# Altium schematic sheet Schematic.schdoc
size 707 x 423 mm
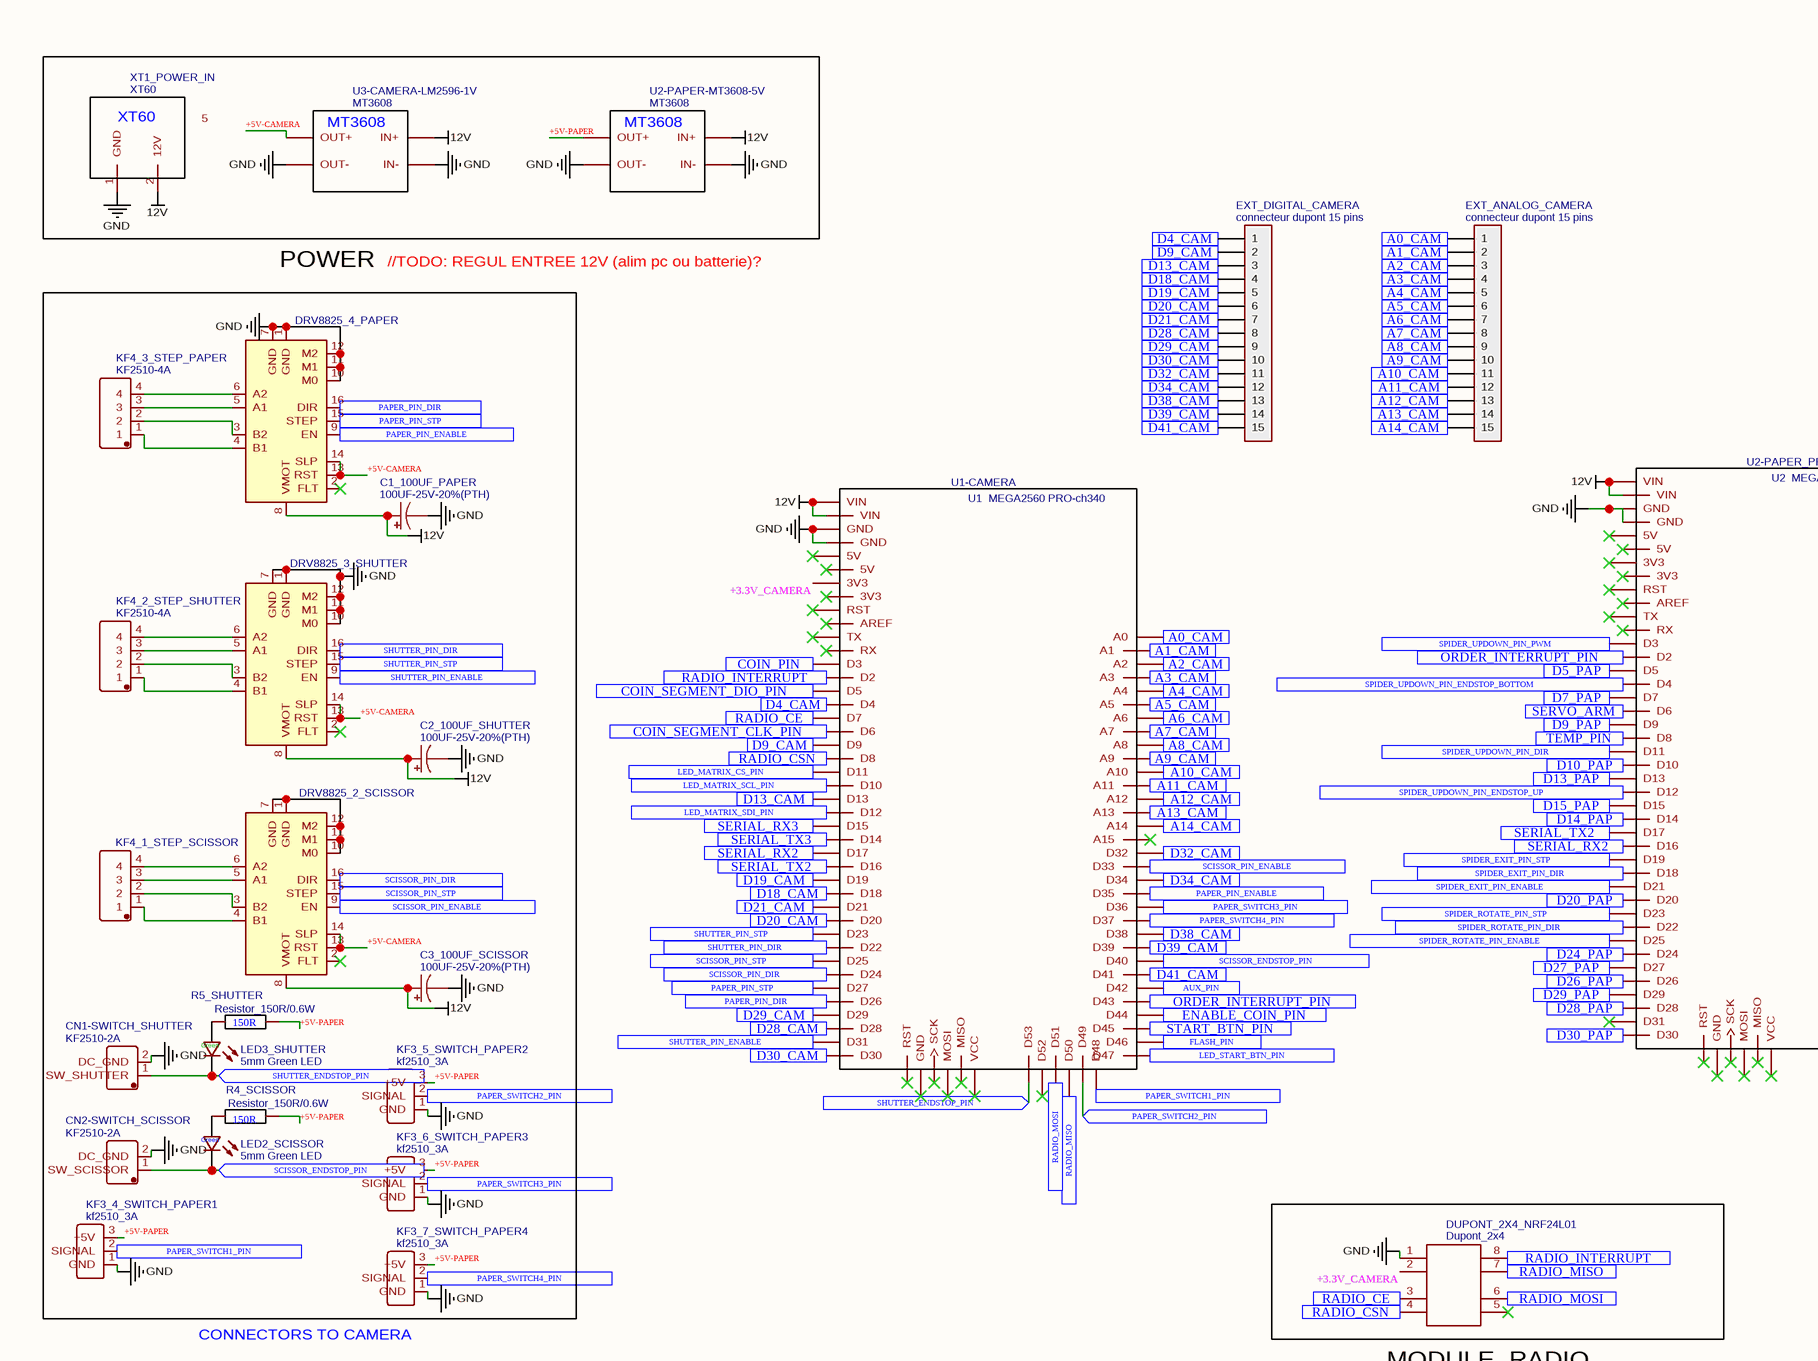
[diagram p0: Schematic.schdoc, top left]
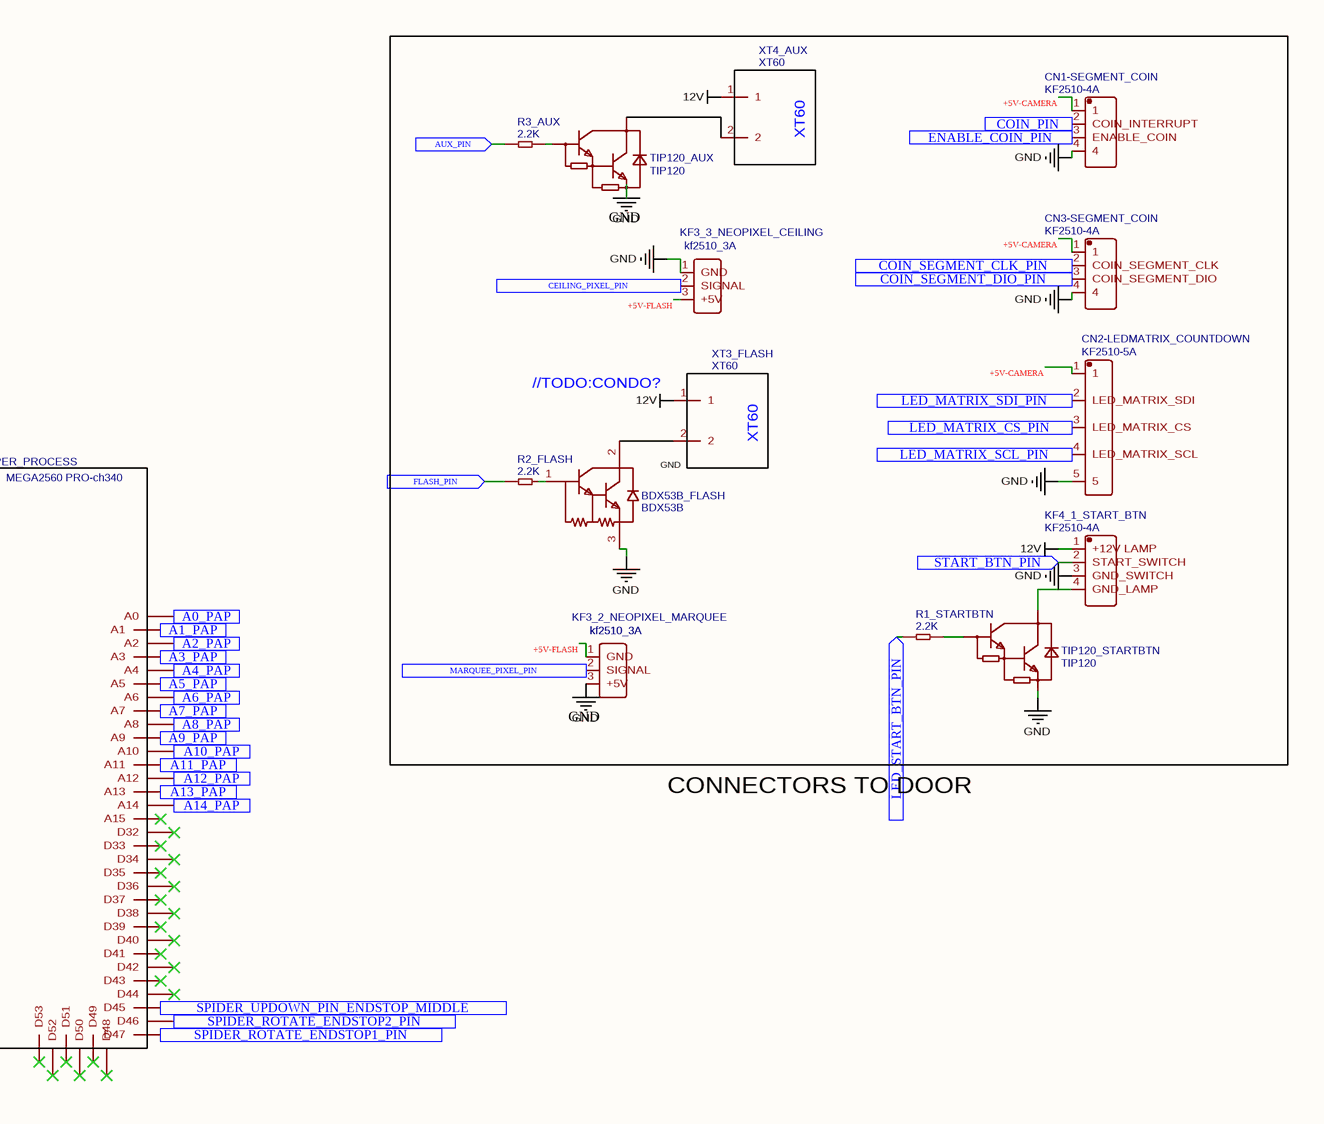
[diagram p1: Schematic.schdoc, top right]
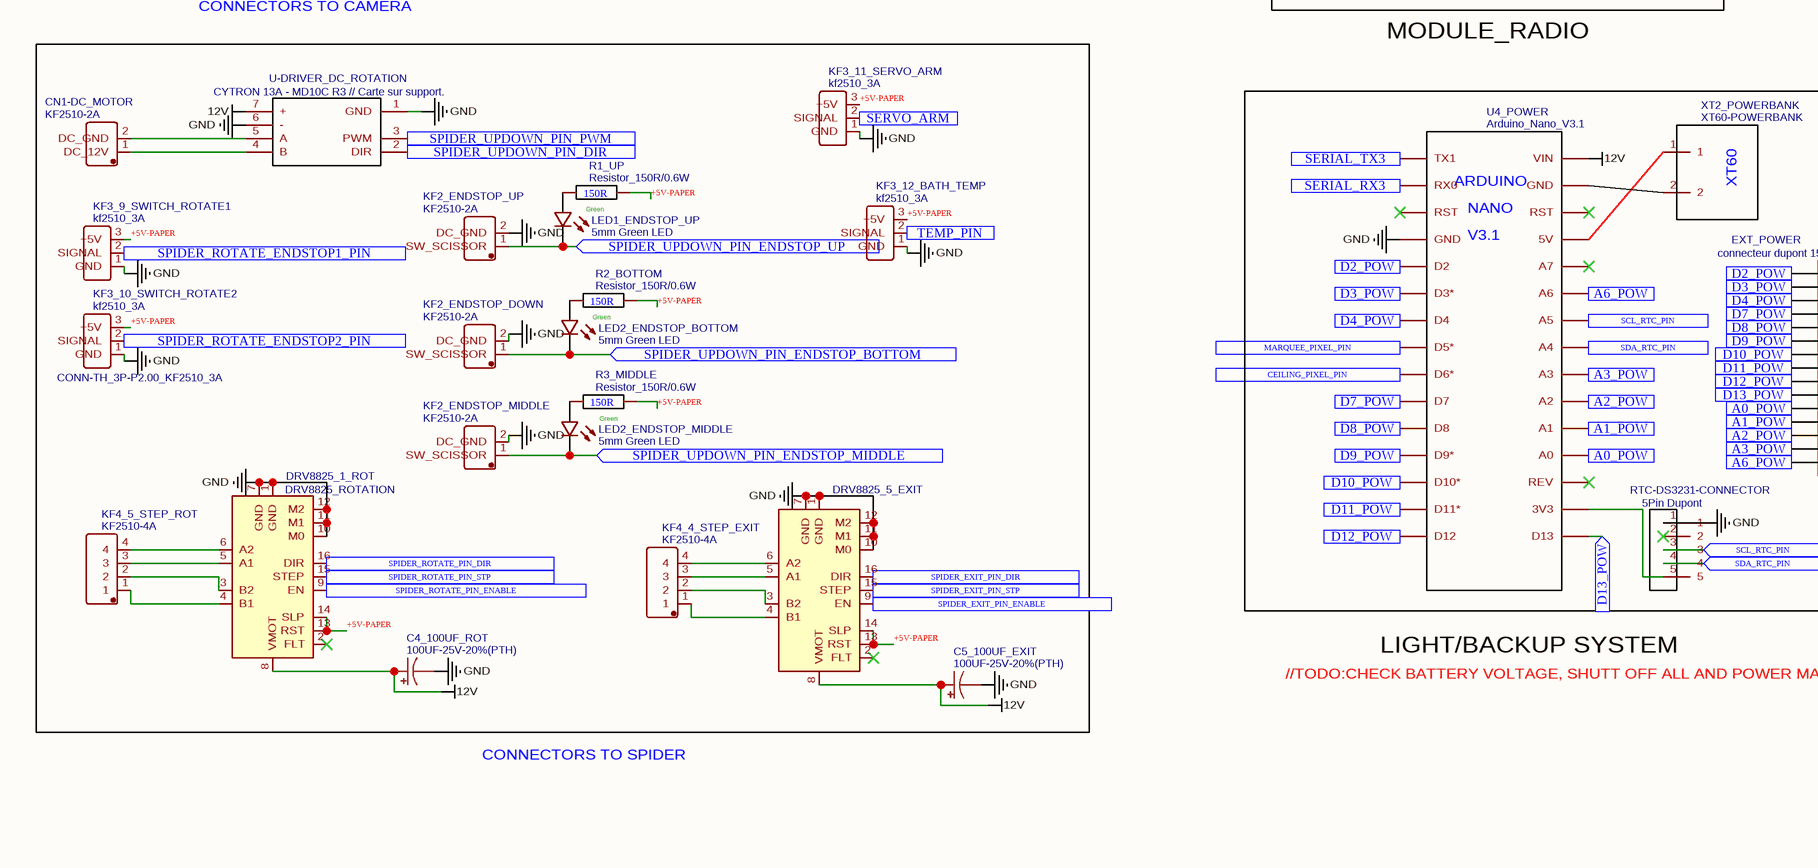
[diagram p2: Schematic.schdoc, bottom left]
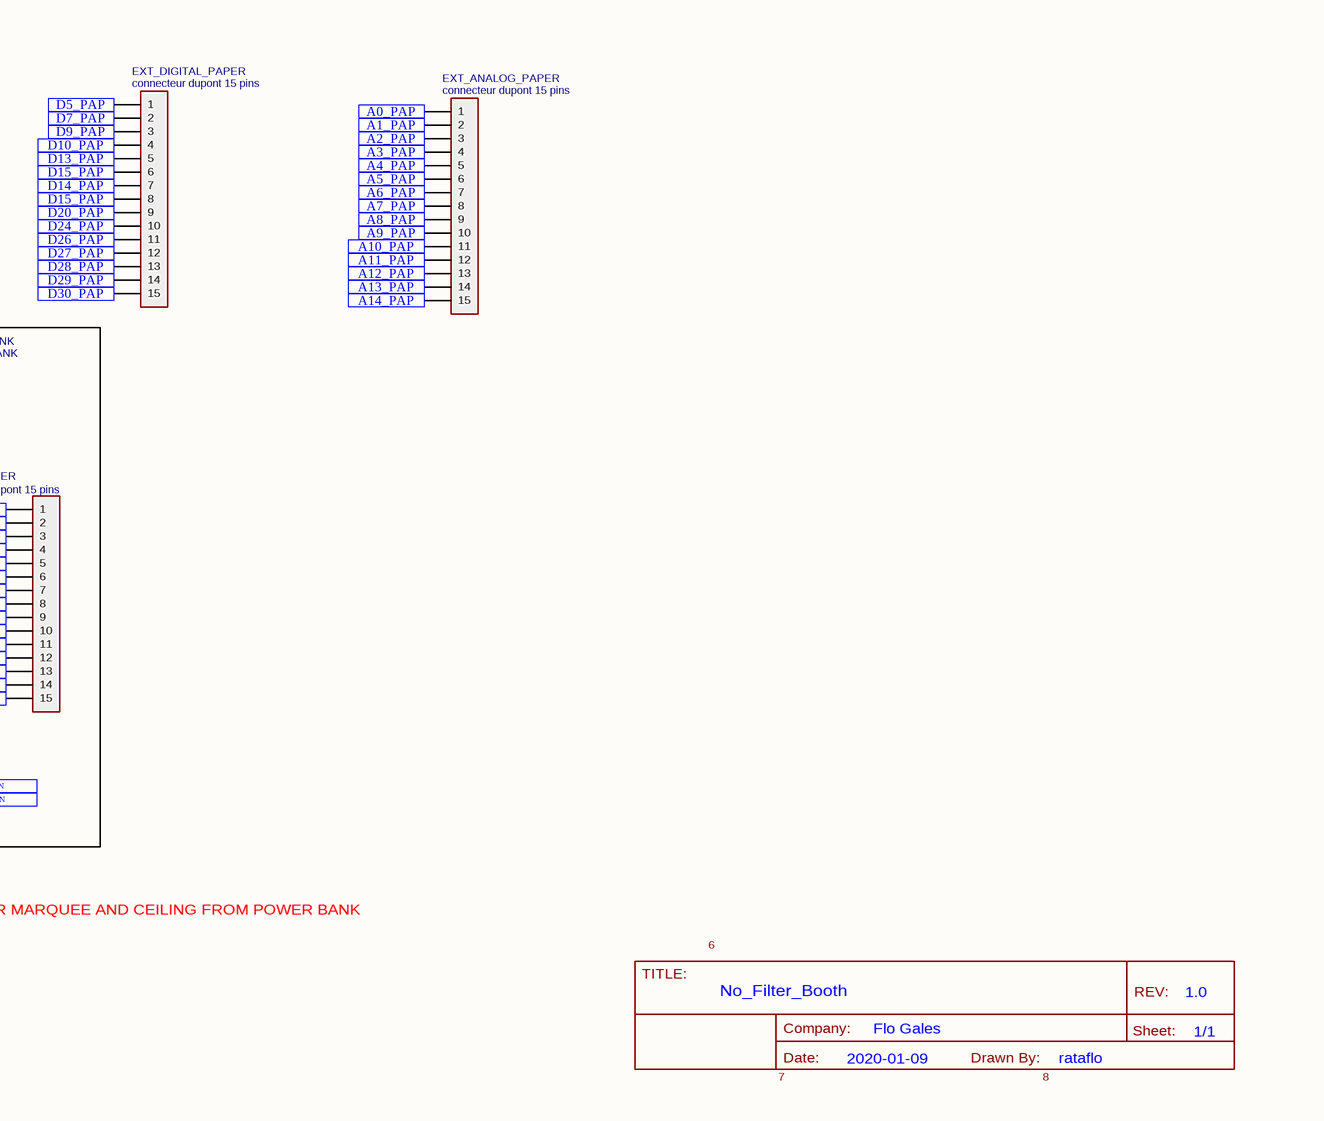
[diagram p3: Schematic.schdoc, bottom right]

## Parts
BDX53B_FLASH  BDX53B  [TO-220]
C1_100UF_PAPER  100UF-25V-20%(PTH)  [CPOL-RADIAL-100UF-25V]
C2_100UF_SHUTTER  100UF-25V-20%(PTH)  [CPOL-RADIAL-100UF-25V]
C3_100UF_SCISSOR  100UF-25V-20%(PTH)  [CPOL-RADIAL-100UF-25V]
C4_100UF_ROT  100UF-25V-20%(PTH)  [CPOL-RADIAL-100UF-25V]
C5_100UF_EXIT  100UF-25V-20%(PTH)  [CPOL-RADIAL-100UF-25V]
CN1-DC_MOTOR  KF2510-2A  [CONN-TH_KF2510-2A]
CN1-SEGMENT_COIN  KF2510-4A  [CONN-TH_4P-P2.54_KF2510-4A]
CN1-SWITCH_SHUTTER  KF2510-2A  [CONN-TH_KF2510-2A]
CN2-LEDMATRIX_COUNTDOWN  KF2510-5A  [KF2510-5A]
CN2-SWITCH_SCISSOR  KF2510-2A  [CONN-TH_KF2510-2A]
CN3-SEGMENT_COIN  KF2510-4A  [CONN-TH_4P-P2.54_KF2510-4A]
CN6-STEP_SCISSOR  KF4_1_STEP_SCISSOR  [CONN-TH_4P-P2.54_KF2510-4A]
DRV8825_1_ROT  DRV8825_ROTATION  [POLOLU_BREAKOUT-16_15.2X20.3MM]
DRV8825_2_SCISSOR  DRV8825_SCISSOR  [POLOLU_BREAKOUT-16_15.2X20.3MM]  (value not drawn)
DRV8825_3_SHUTTER  DRV8825_SHUTTER  [POLOLU_BREAKOUT-16_15.2X20.3MM]  (value not drawn)
DRV8825_4_PAPER  DRV8825_PAPER  [POLOLU_BREAKOUT-16_15.2X20.3MM]  (value not drawn)
DRV8825_5_EXIT  DRV8825_EXIT  [POLOLU_BREAKOUT-16_15.2X20.3MM]  (value not drawn)
DUPONT_2X4_NRF24L01  Dupont_2x4  [HEADER 4X2]
EXT_ANALOG_CAMERA  connecteur dupont 15 pins  [DUPONT_MALE_16X1_ARNOZ]
EXT_ANALOG_PAPER  connecteur dupont 15 pins  [DUPONT_MALE_16X1_ARNOZ]
EXT_DIGITAL_CAMERA  connecteur dupont 15 pins  [DUPONT_MALE_16X1_ARNOZ]
EXT_DIGITAL_PAPER  connecteur dupont 15 pins  [DUPONT_MALE_16X1_ARNOZ]
EXT_POWER  connecteur dupont 15 pins  [DUPONT_MALE_16X1_ARNOZ]
KF2_ENDSTOP_DOWN  KF2510-2A  [CONN-TH_KF2510-2A]
KF2_ENDSTOP_MIDDLE  KF2510-2A  [CONN-TH_KF2510-2A]
KF2_ENDSTOP_UP  KF2510-2A  [CONN-TH_KF2510-2A]
KF3_2_NEOPIXEL_MARQUEE  kf2510_3A  [CONN-TH_3P-P2.00_KF2510_3A]
KF3_3_NEOPIXEL_CEILING  kf2510_3A  [CONN-TH_3P-P2.00_KF2510_3A]
KF3_4_SWITCH_PAPER1  kf2510_3A  [CONN-TH_3P-P2.00_KF2510_3A]
KF3_5_SWITCH_PAPER2  kf2510_3A  [CONN-TH_3P-P2.00_KF2510_3A]
KF3_6_SWITCH_PAPER3  kf2510_3A  [CONN-TH_3P-P2.00_KF2510_3A]
KF3_7_SWITCH_PAPER4  kf2510_3A  [CONN-TH_3P-P2.00_KF2510_3A]
KF3_9_SWITCH_ROTATE1  kf2510_3A  [CONN-TH_3P-P2.00_KF2510_3A]
KF3_10_SWITCH_ROTATE2  kf2510_3A  [CONN-TH_3P-P2.00_KF2510_3A]
KF3_11_SERVO_ARM  kf2510_3A  [CONN-TH_3P-P2.00_KF2510_3A]
KF3_12_BATH_TEMP  kf2510_3A  [CONN-TH_3P-P2.00_KF2510_3A]
KF4_1_START_BTN  KF2510-4A  [CONN-TH_4P-P2.54_KF2510-4A]
KF4_2_STEP_SHUTTER  KF2510-4A  [CONN-TH_4P-P2.54_KF2510-4A]
KF4_3_STEP_PAPER  KF2510-4A  [CONN-TH_4P-P2.54_KF2510-4A]
KF4_4_STEP_EXIT  KF2510-4A  [CONN-TH_4P-P2.54_KF2510-4A]
KF4_5_STEP_ROT  KF2510-4A  [CONN-TH_4P-P2.54_KF2510-4A]
LED1_ENDSTOP_UP  5mm Green LED  [5MM_LED_2.54]
LED2_ENDSTOP_BOTTOM  5mm Green LED  [5MM_LED_2.54]
LED2_ENDSTOP_MIDDLE  5mm Green LED  [5MM_LED_2.54]
LED2_SCISSOR  5mm Green LED  [5MM_LED_2.54]
LED3_SHUTTER  5mm Green LED  [5MM_LED_2.54]
R1_STARTBTN  2.2K  [RES-2.3]
R1_UP  Resistor_150R/0.6W  [ER_RESISTOR_150R/0.6_W]
R2_BOTTOM  Resistor_150R/0.6W  [ER_RESISTOR_150R/0.6_W]
R2_FLASH  2.2K  [RES-2.3]
R3_AUX  2.2K  [RES-2.3]
R3_MIDDLE  Resistor_150R/0.6W  [ER_RESISTOR_150R/0.6_W]
R4_SCISSOR  Resistor_150R/0.6W  [ER_RESISTOR_150R/0.6_W]
R5_SHUTTER  Resistor_150R/0.6W  [ER_RESISTOR_150R/0.6_W]
RTC-DS3231-CONNECTOR  5Pin Dupont  [5PIN DUPONT]
TEST  test2  (value not drawn)
TIP120_AUX  TIP120  [TO-220-3_L10.0-W4.5-P2.54-L]
TIP120_STARTBTN  TIP120  [TO-220-3_L10.0-W4.5-P2.54-L]
U1-CAMERA  MEGA2560_CAMERA  [MEGA2560 PRO-CH340G]  (value not drawn)
U2-PAPER-MT3608-5V  MT3608  [MT3608]
U2-PAPER_PROCESS  MEGA2560_PAPER_PROCESS  [MEGA2560 PRO-CH340G]  (value not drawn)
U3-CAMERA-LM2596-1V  MT3608  [MT3608]
U4_POWER  Arduino_Nano_V3.1  [ARDUINO NANO]
U-DRIVER_DC_ROTATION  CYTRON 13A - MD10C R3 // Carte sur support.  [MD10C]
XT1_POWER_IN  XT60  [XT60]
XT2_POWERBANK  XT60-POWERBANK  [XT60]
XT3_FLASH  XT60  [XT60]
XT4_AUX  XT60  [XT60]

## Blocks framed on the sheet
5: U2-PAPER-MT3608-5V U3-CAMERA-LM2596-1V XT1_POWER_IN

## Ports
A0_CAM (in), A0_PAP (in), A0_POW (in), A1_CAM (in), A1_PAP (in), A1_POW (in), A2_CAM (in), A2_PAP (in), A2_POW (in), A3_CAM (in), A3_PAP (in), A3_POW (in), A4_CAM (in), A4_PAP (in), A5_CAM (in), A5_PAP (in), A6_CAM (in), A6_PAP (in), A6_POW (in), A7_CAM (in), A7_PAP (in), A8_CAM (in), A8_PAP (in), A9_CAM (in), A9_PAP (in), A10_CAM (in), A10_PAP (in), A11_CAM (in), A11_PAP (in), A12_CAM (in), A12_PAP (in), A13_CAM (in), A13_PAP (in), A14_CAM (in), A14_PAP (in), AUX_PIN (in), CEILING_PIXEL_PIN (in), COIN_PIN (in), COIN_SEGMENT_CLK_PIN (in), COIN_SEGMENT_DIO_PIN (in), D2_POW (in), D3_POW (in), D4_CAM (in), D4_POW (in), D5_PAP (in), D7_PAP (in), D7_POW (in), D8_POW (in), D9_CAM (in), D9_PAP (in), D9_POW (in), D10_PAP (in), D10_POW (in), D11_POW (in), D12_POW (in), D13_CAM (in), D13_PAP (in), D13_POW (in), D14_PAP (in), D15_PAP (in), D18_CAM (in), D19_CAM (in), D20_CAM (in), D20_PAP (in), D21_CAM (in), D24_PAP (in), D26_PAP (in), D27_PAP (in), D28_CAM (in), D28_PAP (in), D29_CAM (in), D29_PAP (in), D30_CAM (in), D30_PAP (in), D32_CAM (in), D34_CAM (in), D38_CAM (in), D39_CAM (in), D41_CAM (in), ENABLE_COIN_PIN (in), FLASH_PIN (in), LED_MATRIX_CS_PIN (in), LED_MATRIX_SCL_PIN (in), LED_MATRIX_SDI_PIN (in), LED_START_BTN_PIN (in), MARQUEE_PIXEL_PIN (in), ORDER_INTERRUPT_PIN (in), PAPER_PIN_DIR (in), PAPER_PIN_ENABLE (in), PAPER_PIN_STP (in), PAPER_SWITCH1_PIN (in), PAPER_SWITCH2_PIN (in), PAPER_SWITCH3_PIN (in), PAPER_SWITCH4_PIN (in), RADIO_CE (in), RADIO_CSN (in), RADIO_INTERRUPT (in), RADIO_MISO (in), RADIO_MOSI (in), SCISSOR_ENDSTOP_PIN (in), SCISSOR_PIN_DIR (in), SCISSOR_PIN_ENABLE (in), SCISSOR_PIN_STP (in), SCL_RTC_PIN (in), SDA_RTC_PIN (in), SERIAL_RX2 (in), SERIAL_RX3 (in), SERIAL_TX2 (in), SERIAL_TX3 (in), SERVO_ARM (in), SHUTTER_ENDSTOP_PIN (in), SHUTTER_PIN_DIR (in), SHUTTER_PIN_ENABLE (in), SHUTTER_PIN_STP (in), SPIDER_EXIT_PIN_DIR (in), SPIDER_EXIT_PIN_ENABLE (in), SPIDER_EXIT_PIN_STP (in), SPIDER_ROTATE_ENDSTOP1_PIN (in), SPIDER_ROTATE_ENDSTOP2_PIN (in), SPIDER_ROTATE_PIN_DIR (in), SPIDER_ROTATE_PIN_ENABLE (in), SPIDER_ROTATE_PIN_STP (in), SPIDER_UPDOWN_PIN_DIR (in), SPIDER_UPDOWN_PIN_ENDSTOP_BOTTOM (in), SPIDER_UPDOWN_PIN_ENDSTOP_MIDDLE (in), SPIDER_UPDOWN_PIN_ENDSTOP_UP (in), SPIDER_UPDOWN_PIN_PWM (in), START_BTN_PIN (in), TEMP_PIN (in)

## Nets
12V: C1_100UF_PAPER.1(+) C2_100UF_SHUTTER.1(+) C3_100UF_SCISSOR.1(+) C4_100UF_ROT.1(+) C5_100UF_EXIT.1(+) DRV8825_1_ROT.8(VMOT) DRV8825_2_SCISSOR.8(VMOT) DRV8825_3_SHUTTER.8(VMOT) DRV8825_4_PAPER.8(VMOT) DRV8825_5_EXIT.8(VMOT) KF4_1_START_BTN.1(+12V_LAMP) U1-CAMERA.85(VIN) U1-CAMERA.86(VIN) U2-PAPER-MT3608-5V.3(IN+) U2-PAPER_PROCESS.85(VIN) U2-PAPER_PROCESS.86(VIN) U3-CAMERA-LM2596-1V.3(IN+) U4_POWER.30(VIN) U-DRIVER_DC_ROTATION.7(+) XT1_POWER_IN.2(12V) XT3_FLASH.1 XT4_AUX.1
GND: BDX53B_FLASH.3(E) C1_100UF_PAPER.2(-) C2_100UF_SHUTTER.2(-) C3_100UF_SCISSOR.2(-) C4_100UF_ROT.2(-) C5_100UF_EXIT.2(-) CN1-SEGMENT_COIN.4 CN1-SWITCH_SHUTTER.2(DC_GND) CN2-LEDMATRIX_COUNTDOWN.5 CN2-SWITCH_SCISSOR.2(DC_GND) CN3-SEGMENT_COIN.4 DRV8825_1_ROT.1(GND) DRV8825_1_ROT.7(GND) DRV8825_1_ROT.10(M0) DRV8825_1_ROT.11(M1) DRV8825_1_ROT.12(M2) DRV8825_3_SHUTTER.1(GND) DRV8825_3_SHUTTER.7(GND) DRV8825_3_SHUTTER.10(M0) DRV8825_3_SHUTTER.11(M1) DRV8825_3_SHUTTER.12(M2) DRV8825_4_PAPER.1(GND) DRV8825_4_PAPER.7(GND) DRV8825_4_PAPER.10(M0) DRV8825_4_PAPER.11(M1) DRV8825_4_PAPER.12(M2) DRV8825_5_EXIT.1(GND) DRV8825_5_EXIT.7(GND) DRV8825_5_EXIT.10(M0) DRV8825_5_EXIT.11(M1) DRV8825_5_EXIT.12(M2) DUPONT_2X4_NRF24L01.1 KF2_ENDSTOP_DOWN.2(DC_GND) KF2_ENDSTOP_MIDDLE.2(DC_GND) KF2_ENDSTOP_UP.2(DC_GND) KF3_2_NEOPIXEL_MARQUEE.3(+5V) KF3_3_NEOPIXEL_CEILING.1(GND) KF3_4_SWITCH_PAPER1.1(GND) KF3_5_SWITCH_PAPER2.1(GND) KF3_6_SWITCH_PAPER3.1(GND) KF3_7_SWITCH_PAPER4.1(GND) KF3_9_SWITCH_ROTATE1.1(GND) KF3_10_SWITCH_ROTATE2.1(GND) KF3_11_SERVO_ARM.1(GND) KF3_12_BATH_TEMP.1(GND) KF4_1_START_BTN.3(GND_SWITCH) RTC-DS3231-CONNECTOR.1 TIP120_AUX.3(E) TIP120_STARTBTN.3(E) U1-CAMERA.83(GND) U1-CAMERA.84(GND) U2-PAPER-MT3608-5V.2(OUT-) U2-PAPER-MT3608-5V.4(IN-) U2-PAPER_PROCESS.83(GND) U2-PAPER_PROCESS.84(GND) U3-CAMERA-LM2596-1V.2(OUT-) U3-CAMERA-LM2596-1V.4(IN-) U4_POWER.4(GND) U-DRIVER_DC_ROTATION.1(GND) U-DRIVER_DC_ROTATION.6(-) XT1_POWER_IN.1(GND)
+3.3V_CAMERA: DUPONT_2X4_NRF24L01.2 U1-CAMERA.80(3V3)
+5V-CAMERA: CN1-SEGMENT_COIN.1 CN2-LEDMATRIX_COUNTDOWN.1 CN3-SEGMENT_COIN.1 DRV8825_2_SCISSOR.13(RST) DRV8825_2_SCISSOR.14(SLP) DRV8825_3_SHUTTER.13(RST) DRV8825_3_SHUTTER.14(SLP) DRV8825_4_PAPER.13(RST) DRV8825_4_PAPER.14(SLP) U3-CAMERA-LM2596-1V.1(OUT+)
+5V-FLASH: KF3_2_NEOPIXEL_MARQUEE.1(GND) KF3_3_NEOPIXEL_CEILING.3(+5V)
+5V-PAPER: DRV8825_1_ROT.13(RST) DRV8825_1_ROT.14(SLP) DRV8825_5_EXIT.13(RST) DRV8825_5_EXIT.14(SLP) KF3_4_SWITCH_PAPER1.3(+5V) KF3_5_SWITCH_PAPER2.3(+5V) KF3_6_SWITCH_PAPER3.3(+5V) KF3_7_SWITCH_PAPER4.3(+5V) KF3_9_SWITCH_ROTATE1.3(+5V) KF3_10_SWITCH_ROTATE2.3(+5V) KF3_11_SERVO_ARM.3(+5V) KF3_12_BATH_TEMP.3(+5V) R1_UP.1 R2_BOTTOM.1 R3_MIDDLE.1 R4_SCISSOR.1 R5_SHUTTER.1 U2-PAPER-MT3608-5V.1(OUT+)
A0_CAM: EXT_ANALOG_CAMERA.1 U1-CAMERA.1(A0) ; port A0_CAM
A0_PAP: EXT_ANALOG_PAPER.1 U2-PAPER_PROCESS.1(A0) ; port A0_PAP
A0_POW: EXT_POWER.11 U4_POWER.19(A0) ; port A0_POW
A1_CAM: EXT_ANALOG_CAMERA.2 U1-CAMERA.2(A1) ; port A1_CAM
A1_PAP: EXT_ANALOG_PAPER.2 U2-PAPER_PROCESS.2(A1) ; port A1_PAP
A1_POW: EXT_POWER.12 U4_POWER.20(A1) ; port A1_POW
A2_CAM: EXT_ANALOG_CAMERA.3 U1-CAMERA.3(A2) ; port A2_CAM
A2_PAP: EXT_ANALOG_PAPER.3 U2-PAPER_PROCESS.3(A2) ; port A2_PAP
A2_POW: EXT_POWER.13 U4_POWER.21(A2) ; port A2_POW
A3_CAM: EXT_ANALOG_CAMERA.4 U1-CAMERA.4(A3) ; port A3_CAM
A3_PAP: EXT_ANALOG_PAPER.4 U2-PAPER_PROCESS.4(A3) ; port A3_PAP
A3_POW: EXT_POWER.14 U4_POWER.22(A3) ; port A3_POW
A4_CAM: EXT_ANALOG_CAMERA.5 U1-CAMERA.5(A4) ; port A4_CAM
A4_PAP: EXT_ANALOG_PAPER.5 U2-PAPER_PROCESS.5(A4) ; port A4_PAP
A5_CAM: EXT_ANALOG_CAMERA.6 U1-CAMERA.6(A5) ; port A5_CAM
A5_PAP: EXT_ANALOG_PAPER.6 U2-PAPER_PROCESS.6(A5) ; port A5_PAP
A6_CAM: EXT_ANALOG_CAMERA.7 U1-CAMERA.7(A6) ; port A6_CAM
A6_PAP: EXT_ANALOG_PAPER.7 U2-PAPER_PROCESS.7(A6) ; port A6_PAP
A6_POW: EXT_POWER.15 U4_POWER.25(A6) ; port A6_POW
A7_CAM: EXT_ANALOG_CAMERA.8 U1-CAMERA.8(A7) ; port A7_CAM
A7_PAP: EXT_ANALOG_PAPER.8 U2-PAPER_PROCESS.8(A7) ; port A7_PAP
A8_CAM: EXT_ANALOG_CAMERA.9 U1-CAMERA.9(A8) ; port A8_CAM
A8_PAP: EXT_ANALOG_PAPER.9 U2-PAPER_PROCESS.9(A8) ; port A8_PAP
A9_CAM: EXT_ANALOG_CAMERA.10 U1-CAMERA.10(A9) ; port A9_CAM
A9_PAP: EXT_ANALOG_PAPER.10 U2-PAPER_PROCESS.10(A9) ; port A9_PAP
A10_CAM: EXT_ANALOG_CAMERA.11 U1-CAMERA.11(A10) ; port A10_CAM
A10_PAP: EXT_ANALOG_PAPER.11 U2-PAPER_PROCESS.11(A10) ; port A10_PAP
A11_CAM: EXT_ANALOG_CAMERA.12 U1-CAMERA.12(A11) ; port A11_CAM
A11_PAP: EXT_ANALOG_PAPER.12 U2-PAPER_PROCESS.12(A11) ; port A11_PAP
A12_CAM: EXT_ANALOG_CAMERA.13 U1-CAMERA.13(A12) ; port A12_CAM
A12_PAP: EXT_ANALOG_PAPER.13 U2-PAPER_PROCESS.13(A12) ; port A12_PAP
A13_CAM: EXT_ANALOG_CAMERA.14 U1-CAMERA.14(A13) ; port A13_CAM
A13_PAP: EXT_ANALOG_PAPER.14 U2-PAPER_PROCESS.14(A13) ; port A13_PAP
A14_CAM: EXT_ANALOG_CAMERA.15 U1-CAMERA.15(A14) ; port A14_CAM
A14_PAP: EXT_ANALOG_PAPER.15 U2-PAPER_PROCESS.15(A14) ; port A14_PAP
AUX_PIN: R3_AUX.1 U1-CAMERA.27(D42) ; port AUX_PIN
CEILING_PIXEL_PIN: KF3_3_NEOPIXEL_CEILING.2(SIGNAL) U4_POWER.9(D6*) ; port CEILING_PIXEL_PIN
COIN_PIN: CN1-SEGMENT_COIN.2(COIN_INTERRUPT) U1-CAMERA.74(D3) ; port COIN_PIN
COIN_SEGMENT_CLK_PIN: CN3-SEGMENT_COIN.2(COIN_SEGMENT_CLK) U1-CAMERA.69(D6) ; port COIN_SEGMENT_CLK_PIN
COIN_SEGMENT_DIO_PIN: CN3-SEGMENT_COIN.3(COIN_SEGMENT_DIO) U1-CAMERA.72(D5) ; port COIN_SEGMENT_DIO_PIN
D2_POW: EXT_POWER.1 U4_POWER.5(D2) ; port D2_POW
D3_POW: EXT_POWER.2 U4_POWER.6(D3*) ; port D3_POW
D4_CAM: EXT_DIGITAL_CAMERA.1 U1-CAMERA.71(D4) ; port D4_CAM
D4_POW: EXT_POWER.3 U4_POWER.7(D4) ; port D4_POW
D5_PAP: EXT_DIGITAL_PAPER.1 U2-PAPER_PROCESS.72(D5) ; port D5_PAP
D7_PAP: EXT_DIGITAL_PAPER.2 U2-PAPER_PROCESS.70(D7) ; port D7_PAP
D7_POW: EXT_POWER.4 U4_POWER.10(D7) ; port D7_POW
D8_POW: EXT_POWER.5 U4_POWER.11(D8) ; port D8_POW
D9_CAM: EXT_DIGITAL_CAMERA.2 U1-CAMERA.68(D9) ; port D9_CAM
D9_PAP: EXT_DIGITAL_PAPER.3 U2-PAPER_PROCESS.68(D9) ; port D9_PAP
D9_POW: EXT_POWER.6 U4_POWER.12(D9*) ; port D9_POW
D10_PAP: EXT_DIGITAL_PAPER.4 U2-PAPER_PROCESS.65(D10) ; port D10_PAP
D10_POW: EXT_POWER.7 U4_POWER.13(D10*) ; port D10_POW
D11_POW: EXT_POWER.8 U4_POWER.14(D11*) ; port D11_POW
D12_POW: EXT_POWER.9 U4_POWER.15(D12) ; port D12_POW
D13_CAM: EXT_DIGITAL_CAMERA.3 U1-CAMERA.64(D13) ; port D13_CAM
D13_PAP: EXT_DIGITAL_PAPER.5 U2-PAPER_PROCESS.64(D13) ; port D13_PAP
D13_POW: EXT_POWER.10 U4_POWER.16(D13) ; port D13_POW
D14_PAP: EXT_DIGITAL_PAPER.7 U2-PAPER_PROCESS.61(D14) ; port D14_PAP
D15_PAP: EXT_DIGITAL_PAPER.6 EXT_DIGITAL_PAPER.8 U2-PAPER_PROCESS.62(D15) ; port D15_PAP
D18_CAM: EXT_DIGITAL_CAMERA.4 U1-CAMERA.57(D18) ; port D18_CAM
D19_CAM: EXT_DIGITAL_CAMERA.5 U1-CAMERA.58(D19) ; port D19_CAM
D20_CAM: EXT_DIGITAL_CAMERA.6 U1-CAMERA.55(D20) ; port D20_CAM
D20_PAP: EXT_DIGITAL_PAPER.9 U2-PAPER_PROCESS.55(D20) ; port D20_PAP
D21_CAM: EXT_DIGITAL_CAMERA.7 U1-CAMERA.56(D21) ; port D21_CAM
D24_PAP: EXT_DIGITAL_PAPER.10 U2-PAPER_PROCESS.51(D24) ; port D24_PAP
D26_PAP: EXT_DIGITAL_PAPER.11 U2-PAPER_PROCESS.49(D26) ; port D26_PAP
D27_PAP: EXT_DIGITAL_PAPER.12 U2-PAPER_PROCESS.50(D27) ; port D27_PAP
D28_CAM: EXT_DIGITAL_CAMERA.8 U1-CAMERA.47(D28) ; port D28_CAM
D28_PAP: EXT_DIGITAL_PAPER.13 U2-PAPER_PROCESS.47(D28) ; port D28_PAP
D29_CAM: EXT_DIGITAL_CAMERA.9 U1-CAMERA.48(D29) ; port D29_CAM
D29_PAP: EXT_DIGITAL_PAPER.14 U2-PAPER_PROCESS.48(D29) ; port D29_PAP
D30_CAM: EXT_DIGITAL_CAMERA.10 U1-CAMERA.45(D30) ; port D30_CAM
D30_PAP: EXT_DIGITAL_PAPER.15 U2-PAPER_PROCESS.45(D30) ; port D30_PAP
D32_CAM: EXT_DIGITAL_CAMERA.11 U1-CAMERA.17(D32) ; port D32_CAM
D34_CAM: EXT_DIGITAL_CAMERA.12 U1-CAMERA.19(D34) ; port D34_CAM
D38_CAM: EXT_DIGITAL_CAMERA.13 U1-CAMERA.23(D38) ; port D38_CAM
D39_CAM: EXT_DIGITAL_CAMERA.14 U1-CAMERA.24(D39) ; port D39_CAM
D41_CAM: EXT_DIGITAL_CAMERA.15 U1-CAMERA.26(D41) ; port D41_CAM
ENABLE_COIN_PIN: CN1-SEGMENT_COIN.3(ENABLE_COIN) U1-CAMERA.29(D44) ; port ENABLE_COIN_PIN
FLASH_PIN: R2_FLASH.1 U1-CAMERA.31(D46) ; port FLASH_PIN
LED_MATRIX_CS_PIN: CN2-LEDMATRIX_COUNTDOWN.3(LED_MATRIX_CS) U1-CAMERA.66(D11) ; port LED_MATRIX_CS_PIN
LED_MATRIX_SCL_PIN: CN2-LEDMATRIX_COUNTDOWN.4(LED_MATRIX_SCL) U1-CAMERA.65(D10) ; port LED_MATRIX_SCL_PIN
LED_MATRIX_SDI_PIN: CN2-LEDMATRIX_COUNTDOWN.2(LED_MATRIX_SDI) U1-CAMERA.63(D12) ; port LED_MATRIX_SDI_PIN
LED_START_BTN_PIN: R1_STARTBTN.1 U1-CAMERA.32(D47) ; port LED_START_BTN_PIN
MARQUEE_PIXEL_PIN: KF3_2_NEOPIXEL_MARQUEE.2(SIGNAL) U4_POWER.8(D5*) ; port MARQUEE_PIXEL_PIN
ORDER_INTERRUPT_PIN: U1-CAMERA.28(D43) U2-PAPER_PROCESS.73(D2) ; port ORDER_INTERRUPT_PIN
PAPER_PIN_DIR: DRV8825_4_PAPER.16(DIR) U1-CAMERA.49(D26) ; port PAPER_PIN_DIR
PAPER_PIN_ENABLE: DRV8825_4_PAPER.9(EN) U1-CAMERA.20(D35) ; port PAPER_PIN_ENABLE
PAPER_PIN_STP: DRV8825_4_PAPER.15(STEP) U1-CAMERA.50(D27) ; port PAPER_PIN_STP
PAPER_SWITCH1_PIN: KF3_4_SWITCH_PAPER1.2(SIGNAL) U1-CAMERA.33(D48) ; port PAPER_SWITCH1_PIN
PAPER_SWITCH2_PIN: KF3_5_SWITCH_PAPER2.2(SIGNAL) U1-CAMERA.34(D49) ; port PAPER_SWITCH2_PIN
PAPER_SWITCH3_PIN: KF3_6_SWITCH_PAPER3.2(SIGNAL) U1-CAMERA.21(D36) ; port PAPER_SWITCH3_PIN
PAPER_SWITCH4_PIN: KF3_7_SWITCH_PAPER4.2(SIGNAL) U1-CAMERA.22(D37) ; port PAPER_SWITCH4_PIN
RADIO_CE: DUPONT_2X4_NRF24L01.3 U1-CAMERA.70(D7) ; port RADIO_CE
RADIO_CSN: DUPONT_2X4_NRF24L01.4 U1-CAMERA.67(D8) ; port RADIO_CSN
RADIO_INTERRUPT: DUPONT_2X4_NRF24L01.8 U1-CAMERA.73(D2) ; port RADIO_INTERRUPT
RADIO_MISO: DUPONT_2X4_NRF24L01.7 U1-CAMERA.35(D50) ; port RADIO_MISO
RADIO_MOSI: DUPONT_2X4_NRF24L01.6 U1-CAMERA.36(D51) ; port RADIO_MOSI
SCISSOR_ENDSTOP_PIN: CN2-SWITCH_SCISSOR.1(SW_SCISSOR) LED2_SCISSOR.2(C) U1-CAMERA.25(D40) ; port SCISSOR_ENDSTOP_PIN
SCISSOR_PIN_DIR: DRV8825_2_SCISSOR.16(DIR) U1-CAMERA.51(D24) ; port SCISSOR_PIN_DIR
SCISSOR_PIN_ENABLE: DRV8825_2_SCISSOR.9(EN) U1-CAMERA.18(D33) ; port SCISSOR_PIN_ENABLE
SCISSOR_PIN_STP: DRV8825_2_SCISSOR.15(STEP) U1-CAMERA.52(D25) ; port SCISSOR_PIN_STP
SCL_RTC_PIN: RTC-DS3231-CONNECTOR.3 U4_POWER.24(A5) ; port SCL_RTC_PIN
SDA_RTC_PIN: RTC-DS3231-CONNECTOR.4 U4_POWER.23(A4) ; port SDA_RTC_PIN
SERIAL_RX2: U1-CAMERA.60(D17) U2-PAPER_PROCESS.59(D16) ; port SERIAL_RX2
SERIAL_RX3: U1-CAMERA.62(D15) U4_POWER.2(RX0) ; port SERIAL_RX3
SERIAL_TX2: U1-CAMERA.59(D16) U2-PAPER_PROCESS.60(D17) ; port SERIAL_TX2
SERIAL_TX3: U1-CAMERA.61(D14) U4_POWER.1(TX1) ; port SERIAL_TX3
SERVO_ARM: KF3_11_SERVO_ARM.2(SIGNAL) U2-PAPER_PROCESS.69(D6) ; port SERVO_ARM
SHUTTER_ENDSTOP_PIN: CN1-SWITCH_SHUTTER.1(SW_SHUTTER) LED3_SHUTTER.2(C) U1-CAMERA.38(D53) ; port SHUTTER_ENDSTOP_PIN
SHUTTER_PIN_DIR: DRV8825_3_SHUTTER.16(DIR) U1-CAMERA.53(D22) ; port SHUTTER_PIN_DIR
SHUTTER_PIN_ENABLE: DRV8825_3_SHUTTER.9(EN) U1-CAMERA.46(D31) ; port SHUTTER_PIN_ENABLE
SHUTTER_PIN_STP: DRV8825_3_SHUTTER.15(STEP) U1-CAMERA.54(D23) ; port SHUTTER_PIN_STP
SPIDER_EXIT_PIN_DIR: DRV8825_5_EXIT.16(DIR) U2-PAPER_PROCESS.57(D18) ; port SPIDER_EXIT_PIN_DIR
SPIDER_EXIT_PIN_ENABLE: DRV8825_5_EXIT.9(EN) U2-PAPER_PROCESS.56(D21) ; port SPIDER_EXIT_PIN_ENABLE
SPIDER_EXIT_PIN_STP: DRV8825_5_EXIT.15(STEP) U2-PAPER_PROCESS.58(D19) ; port SPIDER_EXIT_PIN_STP
SPIDER_ROTATE_ENDSTOP1_PIN: KF3_9_SWITCH_ROTATE1.2(SIGNAL) U2-PAPER_PROCESS.32(D47) ; port SPIDER_ROTATE_ENDSTOP1_PIN
SPIDER_ROTATE_ENDSTOP2_PIN: KF3_10_SWITCH_ROTATE2.2(SIGNAL) U2-PAPER_PROCESS.31(D46) ; port SPIDER_ROTATE_ENDSTOP2_PIN
SPIDER_ROTATE_PIN_DIR: DRV8825_1_ROT.16(DIR) U2-PAPER_PROCESS.53(D22) ; port SPIDER_ROTATE_PIN_DIR
SPIDER_ROTATE_PIN_ENABLE: DRV8825_1_ROT.9(EN) U2-PAPER_PROCESS.52(D25) ; port SPIDER_ROTATE_PIN_ENABLE
SPIDER_ROTATE_PIN_STP: DRV8825_1_ROT.15(STEP) U2-PAPER_PROCESS.54(D23) ; port SPIDER_ROTATE_PIN_STP
SPIDER_UPDOWN_PIN_DIR: U2-PAPER_PROCESS.66(D11) U-DRIVER_DC_ROTATION.2(DIR) ; port SPIDER_UPDOWN_PIN_DIR
SPIDER_UPDOWN_PIN_ENDSTOP_BOTTOM: KF2_ENDSTOP_DOWN.1(SW_SCISSOR) LED2_ENDSTOP_BOTTOM.2(C) U2-PAPER_PROCESS.71(D4) ; port SPIDER_UPDOWN_PIN_ENDSTOP_BOTTOM
SPIDER_UPDOWN_PIN_ENDSTOP_MIDDLE: KF2_ENDSTOP_MIDDLE.1(SW_SCISSOR) LED2_ENDSTOP_MIDDLE.2(C) U2-PAPER_PROCESS.30(D45) ; port SPIDER_UPDOWN_PIN_ENDSTOP_MIDDLE
SPIDER_UPDOWN_PIN_ENDSTOP_UP: KF2_ENDSTOP_UP.1(SW_SCISSOR) LED1_ENDSTOP_UP.2(C) U2-PAPER_PROCESS.63(D12) ; port SPIDER_UPDOWN_PIN_ENDSTOP_UP
SPIDER_UPDOWN_PIN_PWM: U2-PAPER_PROCESS.74(D3) U-DRIVER_DC_ROTATION.3(PWM) ; port SPIDER_UPDOWN_PIN_PWM
START_BTN_PIN: KF4_1_START_BTN.2(START_SWITCH) U1-CAMERA.30(D45) ; port START_BTN_PIN
TEMP_PIN: KF3_12_BATH_TEMP.2(SIGNAL) U2-PAPER_PROCESS.67(D8) ; port TEMP_PIN
NetBDX53B_FLASH_1: BDX53B_FLASH.1(B) R2_FLASH.2
NetBDX53B_FLASH_2: BDX53B_FLASH.2(C) XT3_FLASH.2
NetCN1-DC_MOTOR_1: CN1-DC_MOTOR.1(DC_12V) U-DRIVER_DC_ROTATION.4(B)
NetCN1-DC_MOTOR_2: CN1-DC_MOTOR.2(DC_GND) U-DRIVER_DC_ROTATION.5(A)
NetCN6-STEP_SCISSOR_1: CN6-STEP_SCISSOR.1 DRV8825_2_SCISSOR.4(B1)
NetCN6-STEP_SCISSOR_2: CN6-STEP_SCISSOR.2 DRV8825_2_SCISSOR.3(B2)
NetCN6-STEP_SCISSOR_3: CN6-STEP_SCISSOR.3 DRV8825_2_SCISSOR.5(A1)
NetCN6-STEP_SCISSOR_4: CN6-STEP_SCISSOR.4 DRV8825_2_SCISSOR.6(A2)
NetDRV8825_1_ROT_3: DRV8825_1_ROT.3(B2) KF4_5_STEP_ROT.2
NetDRV8825_1_ROT_4: DRV8825_1_ROT.4(B1) KF4_5_STEP_ROT.1
NetDRV8825_1_ROT_5: DRV8825_1_ROT.5(A1) KF4_5_STEP_ROT.3
NetDRV8825_1_ROT_6: DRV8825_1_ROT.6(A2) KF4_5_STEP_ROT.4
NetDRV8825_2_SCISSOR_1: DRV8825_2_SCISSOR.1(GND) DRV8825_2_SCISSOR.7(GND) DRV8825_2_SCISSOR.10(M0) DRV8825_2_SCISSOR.11(M1) DRV8825_2_SCISSOR.12(M2)
NetDRV8825_3_SHUTTER_3: DRV8825_3_SHUTTER.3(B2) KF4_2_STEP_SHUTTER.2
NetDRV8825_3_SHUTTER_4: DRV8825_3_SHUTTER.4(B1) KF4_2_STEP_SHUTTER.1
NetDRV8825_3_SHUTTER_5: DRV8825_3_SHUTTER.5(A1) KF4_2_STEP_SHUTTER.3
NetDRV8825_3_SHUTTER_6: DRV8825_3_SHUTTER.6(A2) KF4_2_STEP_SHUTTER.4
NetDRV8825_4_PAPER_3: DRV8825_4_PAPER.3(B2) KF4_3_STEP_PAPER.2
NetDRV8825_4_PAPER_4: DRV8825_4_PAPER.4(B1) KF4_3_STEP_PAPER.1
NetDRV8825_4_PAPER_5: DRV8825_4_PAPER.5(A1) KF4_3_STEP_PAPER.3
NetDRV8825_4_PAPER_6: DRV8825_4_PAPER.6(A2) KF4_3_STEP_PAPER.4
NetDRV8825_5_EXIT_3: DRV8825_5_EXIT.3(B2) KF4_4_STEP_EXIT.2
NetDRV8825_5_EXIT_4: DRV8825_5_EXIT.4(B1) KF4_4_STEP_EXIT.1
NetDRV8825_5_EXIT_5: DRV8825_5_EXIT.5(A1) KF4_4_STEP_EXIT.3
NetDRV8825_5_EXIT_6: DRV8825_5_EXIT.6(A2) KF4_4_STEP_EXIT.4
NetKF4_1_START_BTN_4: KF4_1_START_BTN.4(GND_LAMP) TIP120_STARTBTN.2(C)
NetLED1_ENDSTOP_UP_1: LED1_ENDSTOP_UP.1(A) R1_UP.2
NetLED2_ENDSTOP_BOTTOM_1: LED2_ENDSTOP_BOTTOM.1(A) R2_BOTTOM.2
NetLED2_ENDSTOP_MIDDLE_1: LED2_ENDSTOP_MIDDLE.1(A) R3_MIDDLE.2
NetLED2_SCISSOR_1: LED2_SCISSOR.1(A) R4_SCISSOR.2
NetLED3_SHUTTER_1: LED3_SHUTTER.1(A) R5_SHUTTER.2
NetR1_STARTBTN_2: R1_STARTBTN.2 TIP120_STARTBTN.1(B)
NetR3_AUX_2: R3_AUX.2 TIP120_AUX.1(B)
NetRTC-DS3231-CONNECTOR_5: RTC-DS3231-CONNECTOR.5 U4_POWER.17(3V3)
NetTIP120_AUX_2: TIP120_AUX.2(C) XT4_AUX.2
NetU4_POWER_27: U4_POWER.27(5V) XT2_POWERBANK.1
NetU4_POWER_29: U4_POWER.29(GND) XT2_POWERBANK.2

Not connected (* = marked no-connect by the designer): DRV8825_1_ROT 2(FLT)*; DRV8825_2_SCISSOR 2(FLT)*; DRV8825_3_SHUTTER 2(FLT)*; DRV8825_4_PAPER 2(FLT)*; DRV8825_5_EXIT 2(FLT)*; DUPONT_2X4_NRF24L01 5*; RTC-DS3231-CONNECTOR 2*; U1-CAMERA 16(A15)* 37(D52)* 39(VCC)* 40(MISO)* 41(MOSI)* 42(SCK)* 43(GND)* 44(RST)* 75(RX)* 76(TX)* 77(AREF)* 78(RST)* 79(3V3)* 81(5V)* 82(5V)*; U2-PAPER_PROCESS 16(A15)* 17(D32)* 18(D33)* 19(D34)* 20(D35)* 21(D36)* 22(D37)* 23(D38)* 24(D39)* 25(D40)* 26(D41)* 27(D42)* 28(D43)* 29(D44)* 33(D48)* 34(D49)* 35(D50)* 36(D51)* 37(D52)* 38(D53)* 39(VCC)* 40(MISO)* 41(MOSI)* 42(SCK)* 43(GND)* 44(RST)* 46(D31)* 75(RX)* 76(TX)* 77(AREF)* 78(RST)* 79(3V3)* 80(3V3)* 81(5V)* 82(5V)*; U4_POWER 3(RST)* 18(REV)* 26(A7)* 28(RST)*

## Notes on the sheet
- POWER
- //TODO: REGUL ENTREE 12V (alim pc ou batterie)?
- //TODO:CONDO?
- GND
- (near KF3_2_NEOPIXEL_MARQUEE) kf2510_3A
- (near KF3_2_NEOPIXEL_MARQUEE) GND
- CONNECTORS TO DOOR
- CONNECTORS TO CAMERA
- (near DUPONT_2X4_NRF24L01) MODULE_RADIO
- LIGHT/BACKUP SYSTEM
- //TODO:CHECK BATTERY VOLTAGE, SHUTT OFF ALL AND POWER MARQUEE AND CEILING FROM POWER BANK
- 6
- CONNECTORS TO SPIDER
- TITLE:
- No_Filter_Booth
- REV:
- 1.0
- 7
- Date:
- Company:
- 2020-01-09
- Flo Gales
- Drawn By:
- 8
- rataflo
- Sheet:
- 1/1
- (in symbol 5mm Green LED) Green
- (in symbol Arduino_Nano_V3.1) ARDUINO; NANO; V3.1
- (in symbol kf2510_3A) CONN-TH_3P-P2.00_KF2510_3A
- (in symbol MEGA2560_CAMERA) U1; MEGA2560 PRO-ch340
- (in symbol MEGA2560_PAPER_PROCESS) U2; MEGA2560 PRO-ch340
- (in symbol Resistor_150R/0.6W) 150R
- (in symbol test2) GND

## Library data of the parts
BDX53B_FLASH = BDX53B: description: Plastic Medium-Power Complementary Silicon Transistor, 3-Pin TO-220, Tube; spicePre: Q; spiceSymbolName: BDX53B
C1_100UF_PAPER C2_100UF_SHUTTER C3_100UF_SCISSOR C4_100UF_ROT C5_100UF_EXIT = 100UF-25V-20%(PTH): description: CAP-08439; Contributor: SparkFun; spicePre: C; spiceSymbolName: 100UF-25V-20%(PTH)
CN1-DC_MOTOR CN1-SWITCH_SHUTTER CN2-SWITCH_SCISSOR KF2_ENDSTOP_DOWN KF2_ENDSTOP_MIDDLE KF2_ENDSTOP_UP = KF2510-2A: BOM_Manufacturer: BOOMELE; spicePre: X; BOM_Supplier: LCSC; BOM_Manufacturer Part: KF2510-2A; BOM_Supplier Part: C27543; spiceSymbolName: KF2510-2A
CN1-SEGMENT_COIN CN3-SEGMENT_COIN KF4_1_START_BTN KF4_2_STEP_SHUTTER KF4_3_STEP_PAPER KF4_4_STEP_EXIT KF4_5_STEP_ROT = KF2510-4A: BOM_Manufacturer: ReliaPro; spicePre: X; BOM_Supplier Part: C27542; BOM_Supplier: LCSC; BOM_Manufacturer Part: KF2510-4A; image: http://image.lceda.cn/szlcsc/C27542.jpg; spiceSymbolName: KF2510-4A
CN2-LEDMATRIX_COUNTDOWN = KF2510-5A: BOM_Manufacturer: ReliaPro; spicePre: X; BOM_Supplier Part: C27544; BOM_Supplier: LCSC; BOM_Manufacturer Part: KF2510-5A; spiceSymbolName: KF2510-5A
CN6-STEP_SCISSOR = KF4_1_STEP_SCISSOR: BOM_Manufacturer: ReliaPro; BOM_Manufacturer Part: KF2510-4A; spicePre: X; BOM_Supplier Part: C27542; BOM_Supplier: LCSC; image: http://image.lceda.cn/szlcsc/C27542.jpg; spiceSymbolName: KF2510-4A
DRV8825_1_ROT = DRV8825_ROTATION: BOM_Manufacturer: Pololu; Contributor: KiCAD; license: https://www.gnu.org/licenses/lgpl-2.1.html; spicePre: A; spiceSymbolName: Pololu_Breakout_DRV8825
DRV8825_2_SCISSOR = DRV8825_SCISSOR: Contributor: KiCAD; license: https://www.gnu.org/licenses/lgpl-2.1.html; spicePre: A; spiceSymbolName: Pololu_Breakout_DRV8825
DRV8825_3_SHUTTER = DRV8825_SHUTTER: Contributor: KiCAD; license: https://www.gnu.org/licenses/lgpl-2.1.html; spicePre: A; spiceSymbolName: Pololu_Breakout_DRV8825
DRV8825_4_PAPER = DRV8825_PAPER: BOM_Manufacturer: Pololu; Contributor: KiCAD; license: https://www.gnu.org/licenses/lgpl-2.1.html; spicePre: A; spiceSymbolName: Pololu_Breakout_DRV8825
DRV8825_5_EXIT = DRV8825_EXIT: BOM_Manufacturer: Pololu; Contributor: KiCAD; license: https://www.gnu.org/licenses/lgpl-2.1.html; spicePre: A; spiceSymbolName: Pololu_Breakout_DRV8825
DUPONT_2X4_NRF24L01 = Dupont_2x4: BOM_Manufacturer Part: Custom; Contributor: Niels Overwijn; spicePre: H; spiceSymbolName: Dupont_2x4
EXT_ANALOG_CAMERA EXT_ANALOG_PAPER EXT_DIGITAL_CAMERA EXT_DIGITAL_PAPER EXT_POWER = connecteur dupont 15 pins: BOM_Manufacturer: ReliaPro; BOM_Manufacturer Part: 1.27mm1*10P Straight Headers  Pins; Contributor: kazanaviciuse; BOM_Supplier Part: C28952; BOM_Supplier: LCSC; image: http://image.lceda.cn/szlcsc/C28952.jpg; spicePre: P; spiceSymbolName: connecteur dupont 15 pins
KF3_2_NEOPIXEL_MARQUEE KF3_3_NEOPIXEL_CEILING KF3_4_SWITCH_PAPER1 KF3_5_SWITCH_PAPER2 KF3_6_SWITCH_PAPER3 KF3_7_SWITCH_PAPER4 KF3_9_SWITCH_ROTATE1 KF3_11_SERVO_ARM = kf2510_3A: BOM_Manufacturer: BOOMELE; spicePre: X; BOM_Supplier: LCSC; BOM_Manufacturer Part: kf2510_3A; image: //image.lceda.cn/szlcsc/C29275.jpg; BOM_Supplier Part: C29275; spiceSymbolName: kf2510_3A
KF3_10_SWITCH_ROTATE2 = kf2510_3A: BOM_Manufacturer: BOOMELE; Package Display: Yes; spicePre: X; BOM_Supplier: LCSC; BOM_Manufacturer Part: kf2510_3A; image: //image.lceda.cn/szlcsc/C29275.jpg; BOM_Supplier Part: C29275; spiceSymbolName: kf2510_3A
KF3_12_BATH_TEMP = kf2510_3A: BOM_Manufacturer: BOOMELE; Package Display: No; spicePre: X; BOM_Supplier: LCSC; BOM_Manufacturer Part: kf2510_3A; image: //image.lceda.cn/szlcsc/C29275.jpg; BOM_Supplier Part: C29275; spiceSymbolName: kf2510_3A
LED1_ENDSTOP_UP LED2_ENDSTOP_BOTTOM LED2_ENDSTOP_MIDDLE LED2_SCISSOR LED3_SHUTTER = 5mm Green LED: BOM_Price (USD): 0.01; Contributor: damanbaral; BOM_Supplier: AliExpress; BOM_Manufacturer Part: 5MMGREENLED; BOM_Link: https://www.aliexpress.com/item/100Pcs-LED-5MM-RED-COLOR-RED-LIGHT-Super-Bright-Bulb-Lamp/32224565677.html?spm=2114.search0104.3.83.34af337eTmEG90&ws_ab_test=searchweb0_0,searchweb201602_1_10152_10151; spicePre: L; spiceSymbolName: 5mm Green LED
R1_STARTBTN R2_FLASH R3_AUX = 2.2K: BOM_Manufacturer Part: FHCFR-1/4W-222J; description: DIP RES 2.2K-5%-1/4W;; BOM_Supplier Part: 301020010; BOM_Supplier: SeeedStudio; spicePre: R; spiceSymbolName: 2.2K
R1_UP R2_BOTTOM R3_MIDDLE R4_SCISSOR R5_SHUTTER = Resistor_150R/0.6W: Contributor: elpeewee; BOM_Supplier Part: undefined; spicePre: R; spiceSymbolName: Resistor_150R/0.6W
RTC-DS3231-CONNECTOR = 5Pin Dupont: Contributor: joeduderey; Package Display: No; spicePre: U; spiceSymbolName: 5Pin Dupont
TIP120_AUX TIP120_STARTBTN = TIP120: BOM_Manufacturer: STMicroelectronics; Contributor: LCSC; BOM_Supplier: LCSC; BOM_Supplier Part: C262990; BOM_Manufacturer Part: TIP120; spicePre: Q; spiceSymbolName: TIP120
U1-CAMERA = MEGA2560_CAMERA: BOM_Manufacturer: RobotDyn; Contributor: brandstetter.sys; BOM_Manufacturer Part: MEGA2560 PRO-ch340G; BOM_Supplier: RobotDyn; BOM_Supplier Part: MEGA2560 PRO-ch340G; link: https://robotdyn.com/mega-2560-pro-embed-ch340g-atmega2560-16au.html; spicePre: U; spiceSymbolName: MEGA2560 PRO-ch340G
U2-PAPER-MT3608-5V U3-CAMERA-LM2596-1V = MT3608: BOM_Manufacturer Part: New SchematicLib; Contributor: nickoass; spicePre: U; spiceSymbolName: MT3608
U2-PAPER_PROCESS = MEGA2560_PAPER_PROCESS: BOM_Manufacturer: RobotDyn; Contributor: brandstetter.sys; BOM_Manufacturer Part: MEGA2560 PRO-ch340G; BOM_Supplier: RobotDyn; BOM_Supplier Part: MEGA2560 PRO-ch340G; link: https://robotdyn.com/mega-2560-pro-embed-ch340g-atmega2560-16au.html; spicePre: U; spiceSymbolName: MEGA2560 PRO-ch340G
U4_POWER = Arduino_Nano_V3.1: Contributor: Tobias Hach; timeStamp: 1475938548; spicePre: U; spiceSymbolName: Arduino_Nano_V3.1
U-DRIVER_DC_ROTATION = CYTRON 13A - MD10C R3 // Carte sur support.: BOM_Manufacturer Part: Cytron 13A, 5-30V Single DC Motor Controller; Contributor: Clemence; Package Display: No; BOM_Supplier Part: undefined; link: https://www.robotshop.com/eu/fr/controleur-un-moteur-13a-5-a-30v-cytron.html?gclid=CjwKCAjwx_boBRA9EiwA4kIELt4WXOb_eNtyrzZ7S0Ph3qvcU_ZLf4o937LRN9Sbs-uF-rttO4zhyBoCeLIQAvD_BwE; spicePre: U; spiceSymbolName: CYTRON 13A - MD10C R3
XT1_POWER_IN XT3_FLASH XT4_AUX = XT60: Contributor: Drone_H2EA; spicePre: U; spiceSymbolName: XT60
XT2_POWERBANK = XT60-POWERBANK: Contributor: Drone_H2EA; spicePre: U; spiceSymbolName: XT60